# EAGLE design motherboard_zaloha s medi (EAGLE 9.6.2)
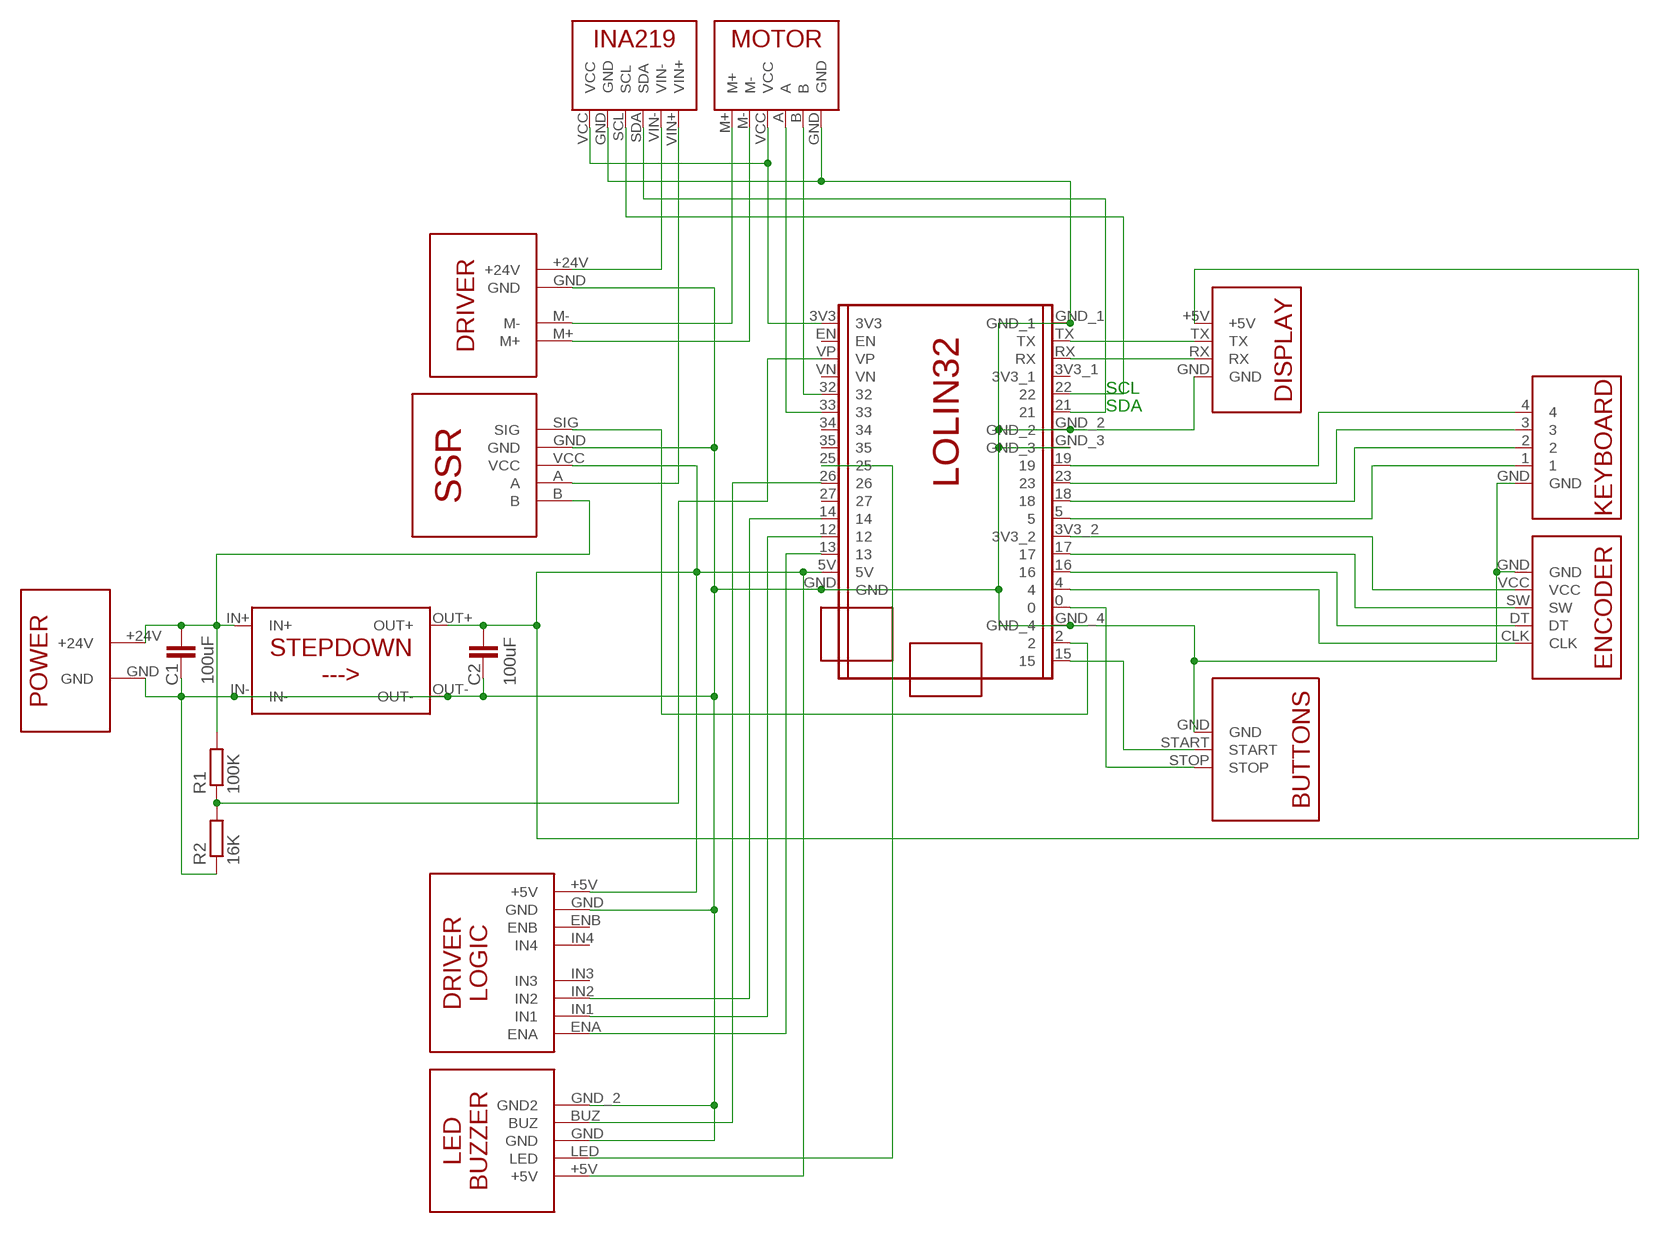
[diagram p0: schematic, sheet 1]

## Parts
C1  100uF  C5/2.5  [C5B2.5]
C2  100uF  C5/2.5  [C5B2.5]
R1  100K  R-EU_0207/7  [0207/7]
R2  16K  R-EU_0207/7  [0207/7]
U$1  B_DISPLAY  [B_DISPLAY]
U$2  INA219  [INA219]
U$3  B_MOTOR  [B_MOTOR]
U$4  B_KLAVESNICE  [B_KLAVESNICE]
U$5  B_LED_BUZ  [B_LED_BUZ]
U$6  B_ENCODER  [B_ENCODER]
U$7  B_SSR_2  [B_SSR_2]
U$8  B_LOLIN32  [B_LOLIN32]
U$9  B_STEPDOWN  [B_STEPDOWN]
U$10  B_DRIVER_3  [B_DRIVER_3]
U$11  B_POWER  [B_POWER]
U$12  B_DRIVER_2  [B_DRIVER_2]
U$13  B_BUTTONS  [B_BUTTONS]

## Nets
+5V [+5V]: C2.1 U$1.+5V U$5.+5V U$7.VCC U$8.5V U$9.OUT+ U$10.+5V
GND [GND]: C1.2 C2.2 R2.1 U$1.GND U$2.GND U$3.GND U$4.GND U$5.GND U$5.GND_2(GND2) U$6.GND U$7.GND U$8.GND U$8.GND_1 U$8.GND_2 U$8.GND_3 U$8.GND_4 U$9.IN- U$9.OUT- U$10.GND U$11.GND U$12.GND U$13.GND
N$1: U$6.VCC U$8.3V3_2
N$2: U$4.1 U$8.5
N$3 [+24v]: U$3.M+ U$12.M-
N$4 [+24v]: U$3.M- U$12.M+
N$5: U$4.2 U$8.18
N$6: U$4.3 U$8.23
N$7: U$6.SW U$8.17
N$8: U$6.DT U$8.16
N$9: U$4.4 U$8.19
N$10: U$8.0 U$13.STOP
N$11: U$7.SIG U$8.2
N$12: U$3.B U$8.32
N$13: U$1.TX U$8.TX
N$14: U$1.RX U$8.RX
N$15: U$3.A U$8.33
N$16: U$6.CLK U$8.4
N$18: U$5.BUZ U$8.26
N$19: U$5.LED U$8.25
N$21 [+24v]: C1.1 R1.2 U$7.B U$9.IN+ U$11.+24V
N$22: U$2.SDA U$8.21
N$23: U$8.15 U$13.START
N$24: U$2.SCL U$8.22
N$27 [+5V]: U$2.VCC U$3.VCC U$8.3V3
N$28 [+24v]: U$2.VIN+ U$7.A
N$29 [+24v]: U$2.VIN- U$12.+24V
N$30: R1.1 R2.2 U$8.VP
N$38: U$8.13 U$10.ENA
N$39: U$8.12 U$10.IN1
N$40: U$8.14 U$10.IN2
Unconnected: U$8.3V3_1 U$8.27 U$8.34 U$8.35 U$8.EN U$8.VN U$10.ENB U$10.IN3 U$10.IN4

## Notes on the sheet
- SCL
- SDA

## Library data of the parts
C1 C2 = capacitor-wima:C: CAPACITOR naming: grid - package width
R1 R2 = rcl:R-EU_: RESISTOR, European symbol; SPICEPREFIX: R
U$1 = 00_arduino:B_DISPLAY
U$2 = 00_arduino:INA219
U$3 = 00_arduino:B_MOTOR
U$4 = 00_arduino:B_KLAVESNICE
U$5 = 00_arduino:B_LED_BUZ
U$6 = 00_arduino:B_ENCODER
U$7 = 00_arduino:B_SSR_2
U$8 = 00_arduino:B_LOLIN32
U$9 = 00_arduino:B_STEPDOWN
U$10 = 00_arduino:B_DRIVER_3
U$11 = 00_arduino:B_POWER
U$12 = 00_arduino:B_DRIVER_2
U$13 = 00_arduino:B_BUTTONS

## Net classes
0 default: width 0.508 mm, clearance 0.127 mm
1 GND: width 1.397 mm, clearance 0.127 mm
2 +5V: width 0.762 mm, clearance 0.127 mm
3 +24v: width 1.397 mm

## Board
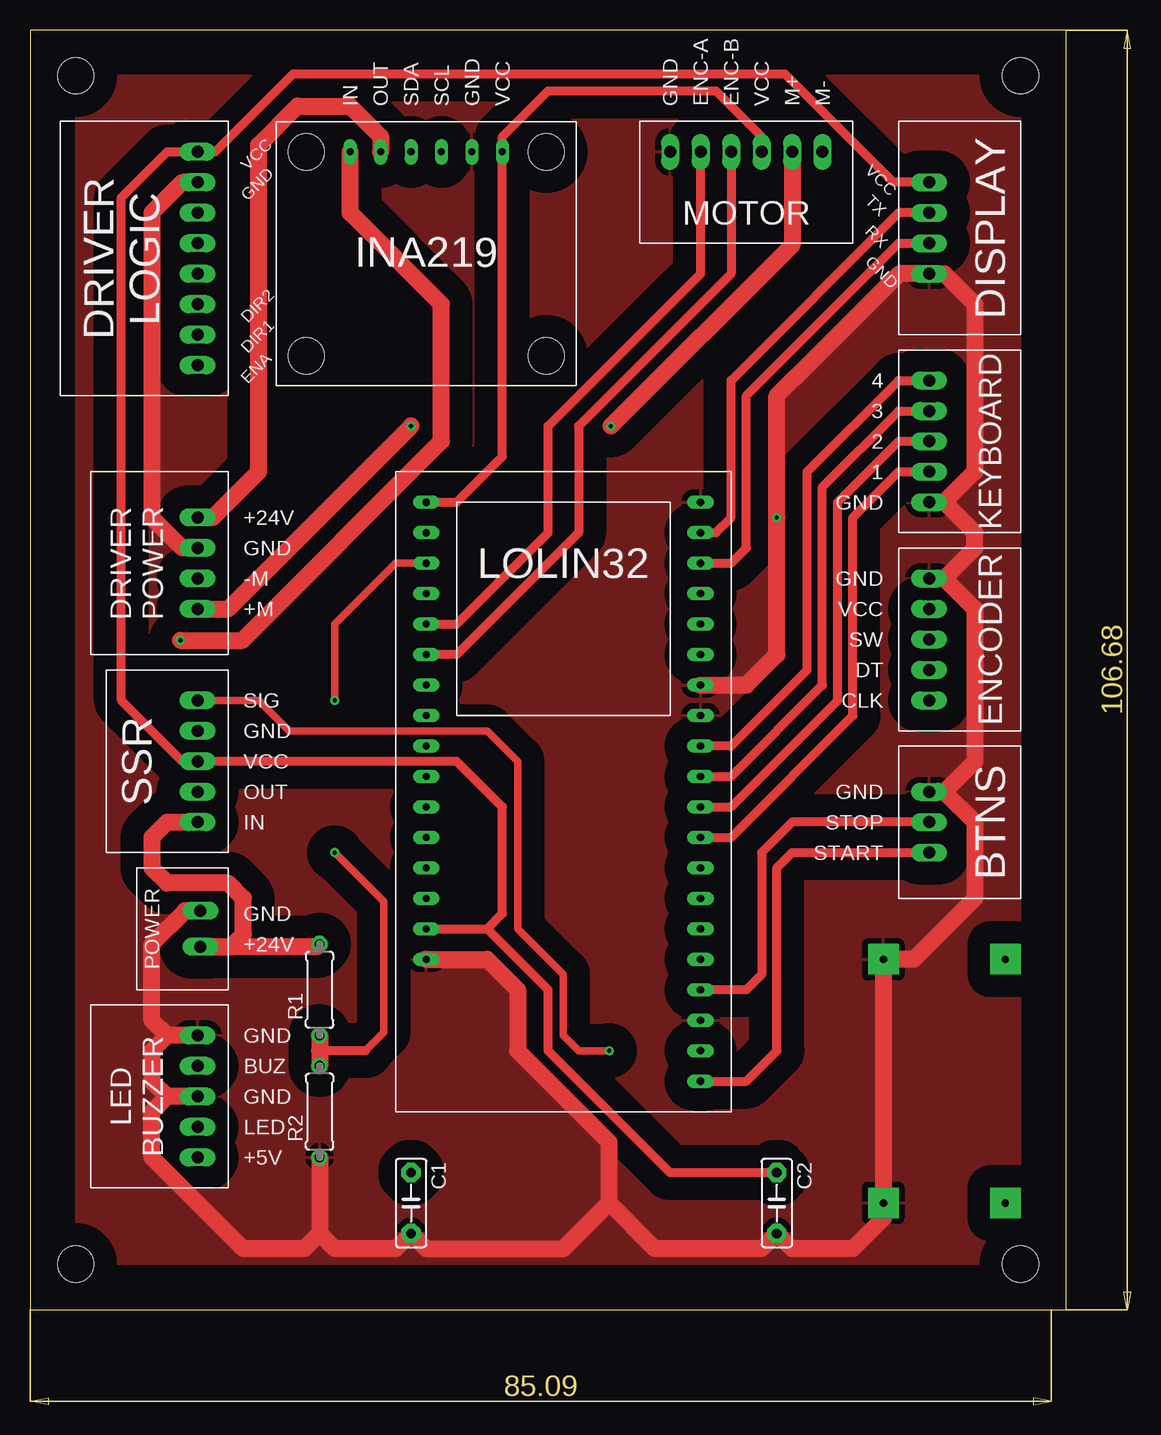
[diagram p1: board, top side]
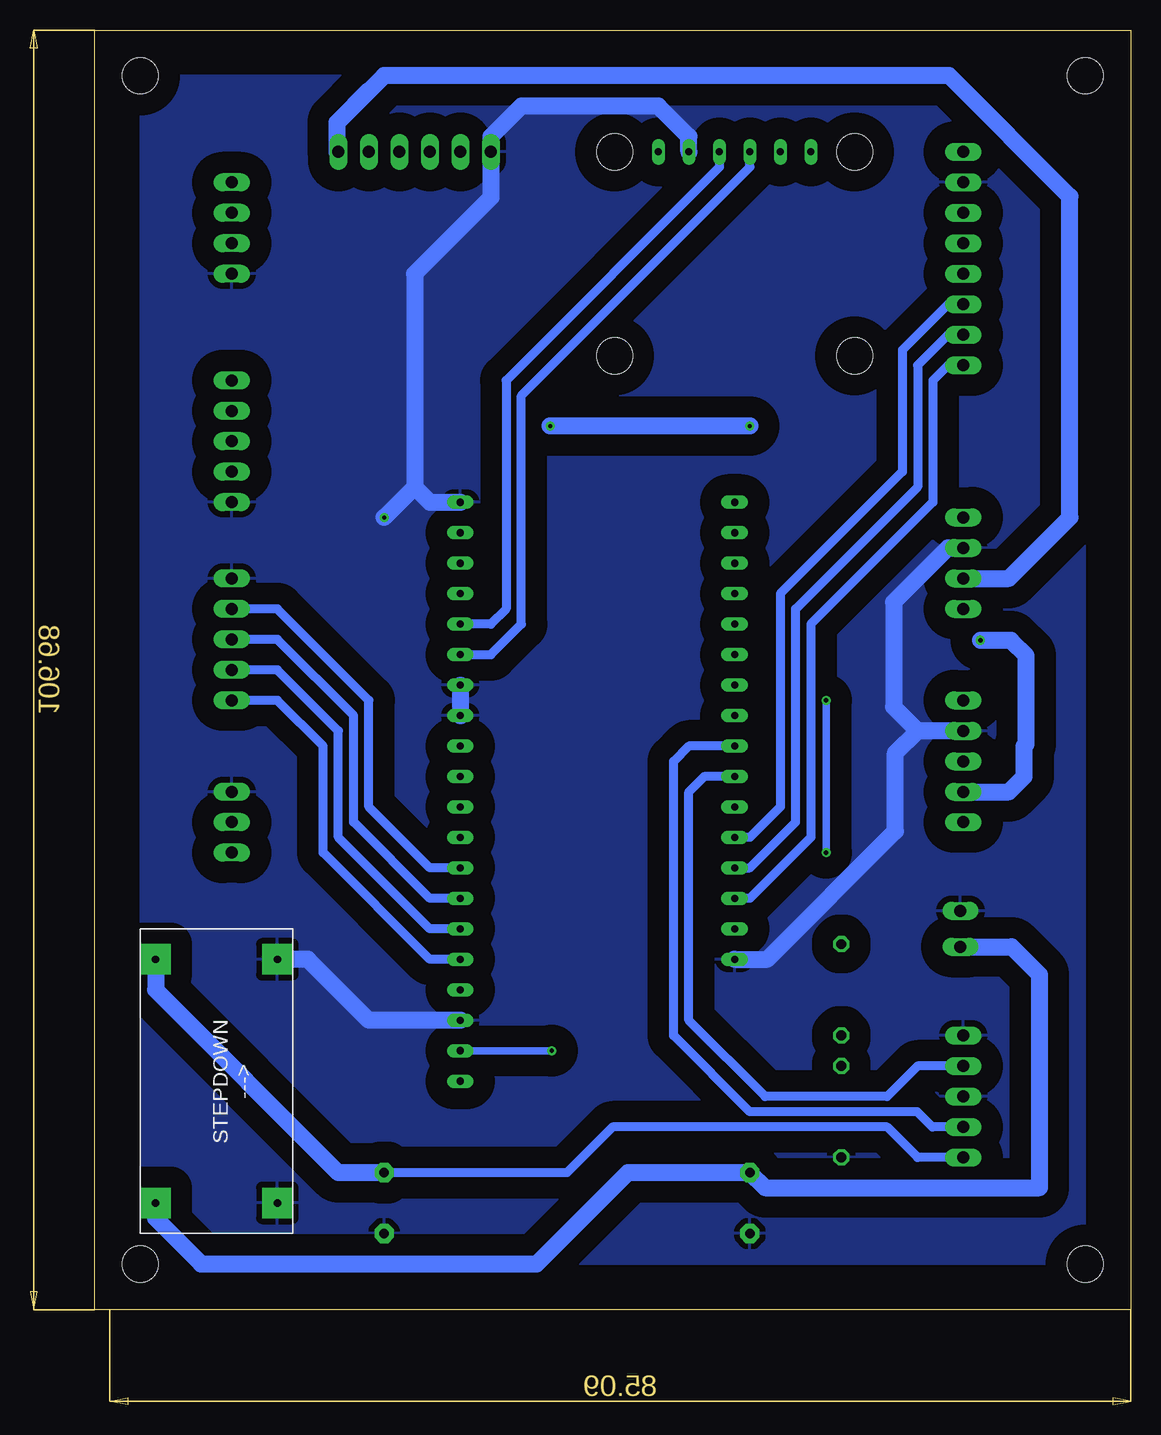
[diagram p2: board, bottom side, seen from below]

Size 86.36 x 106.68 mm. Coordinates in mm from the lower left corner, seen from the top.
Outline: 0,0 86.36,0 86.36,106.68 0,106.68 0,0
Copper layers (1*16): Top 0.035mm / dielectric 1.5mm / Bottom 0.035mm
Design rules "default *": minimum track width 6mil, minimum drill 0.35mm, track to track 6mil, track to pad 6mil, pad to pad 6mil, via to via 6mil, smd to smd 6mil, copper to edge 40mil, drill to drill 6mil, minimum pad ring 10mil, minimum via ring 8mil, stop-mask expansion 4mil, vias tented up to drill 0mil, thermal gap 20mil
Holes 3 mm at 3.81,3.81 82.55,3.81 82.55,102.87 3.81,102.87

### Footprints (pad centres in the part's own frame; a part is rotated, then mirrored left to right if it is on the bottom)
C5B2.5 = drill 0.813 pad 1.6 octagon: 1 -2.54,0; 2 2.54,0
0207/7 = drill 0.813 octagon: 1 -3.81,0; 2 3.81,0
B_DISPLAY = drill 1 long: +5V 0,0; GND 7.62,0; RX 5.08,0; TX 2.54,0
INA219 = drill 0.584 long: GND -3.81,0; SCL -1.27,0; SDA 1.27,0; VCC -6.35,0; VIN+ 6.35,0; VIN- 3.81,0 | hole 3: -10,0; 10,0; -10,17; 10,17
B_MOTOR = drill 1 long: A 2.54,0; B 5.08,0; GND 7.62,0; M+ -5.08,0; M- -2.54,0; VCC 0,0
B_KLAVESNICE = drill 1 long: 1 2.54,0; 2 0,0; 3 -2.54,0; 4 -5.08,0; GND 5.08,0
B_LED_BUZ = drill 1 long: +5V -5.08,0; BUZ 2.54,0; GND 0,0; GND_2 5.08,0; LED -2.54,0
B_ENCODER = drill 1 long: CLK 5.08,0; DT 2.54,0; GND -5.08,0; SW 0,0; VCC -2.54,0
B_SSR_2 = drill 1 long: A -2.54,-2.54; B -5.08,-2.54; GND 2.54,-2.54; SIG 5.08,-2.54; VCC 0,-2.54
B_LOLIN32 = drill 0.6 long: 0 11.43,-27.94; 2 11.43,-33.02; 3V3 -11.43,12.7; 3V3_1 11.43,5.08; 3V3_2 11.43,-17.78; 4 11.43,-25.4; 5 11.43,-15.24; 5V -11.43,-22.86; 12 -11.43,-17.78; 13 -11.43,-20.32; 14 -11.43,-15.24; 15 11.43,-35.56; 16 11.43,-22.86; 17 11.43,-20.32; 18 11.43,-12.7; 19 11.43,-7.62; 21 11.43,0; 22 11.43,2.54; 23 11.43,-10.16; 25 -11.43,-7.62; 26 -11.43,-10.16; 27 -11.43,-12.7; 32 -11.43,2.54; 33 -11.43,0; 34 -11.43,-2.54; 35 -11.43,-5.08; EN -11.43,10.16; GND -11.43,-25.4; GND_1 11.43,12.7; GND_2 11.43,-2.54; GND_3 11.43,-5.08; GND_4 11.43,-30.48; RX 11.43,7.62; TX 11.43,10.16; VN -11.43,5.08; VP -11.43,7.62
B_STEPDOWN = drill 0.6 pad 2.54 square: IN+ -10.16,5.08; IN- -10.16,-5.08; OUT+ 10.16,5.08; OUT- 10.16,-5.08
B_DRIVER_3 = drill 1 long: +5V 17.78,0; ENA 0,0; ENB 12.7,0; GND 15.24,0; IN1 2.54,0; IN2 5.08,0; IN3 7.62,0; IN4 10.16,0
B_POWER = drill 1 long: +24V -1.5,-1.5; GND 1.5,-1.5
B_DRIVER_2 = drill 1 long: +24V 3.81,0; GND 1.27,0; M+ -3.81,0; M- -1.27,0
B_BUTTONS = drill 1 long: GND -2.54,0; START 2.54,0; STOP 0,0

### Placement (x,y rotation side)
C1  31.75,8.89 270 top
C2  62.23,8.89 270 top
R1  24.13,26.67 90 top
R2  24.13,16.51 90 top
U$1  74.93,93.98 270 top
U$2  33.02,96.52 180 top
U$3  60.96,96.52 180 top
U$4  74.93,72.39 270 top
U$5  13.97,17.78 90 top
U$6  74.93,55.88 270 top
U$7  11.43,45.72 90 top
U$8  44.45,54.61 0 top
U$9  76.2,19.05 90 bottom
U$10  13.97,78.74 90 top
U$11  12.7,31.75 90 top
U$12  13.97,62.23 90 top
U$13  74.93,40.64 270 top

### Tracks (layer width: path | path; a pad name or v marks a point on that pad's centre or on a via)
+5V
  Top 0.762: U$1.+5V 74.91,94.04 71.88,94.04 62.9,103.02 21.92,103.02 15.42,96.52 U$10.+5V 11.43,96.52 7.62,92.71 7.62,50.8 12.7,45.72 U$7.VCC 35.56,45.72 39.37,41.91 39.37,33.02 38.1,31.75 | 38.1,31.75 43.18,26.67 43.18,21.59 53.34,11.43 C2.1 | U$8.5V 38.1,31.75
  Bottom 0.762: C2.1 46.99,11.43 43.18,15.24 20.32,15.24 17.78,12.7 U$5.+5V
  Bottom 1.397: U$9.OUT+ 81.28,26.67 66.04,11.43 C2.1
GND  (via drill 0.35)
  Top 1.397: U$11.GND 12.93,33.25 10.16,30.48 10.16,24.13 11.43,22.86 | U$8.GND 38.1,29.21 40.64,26.67 40.64,21.59 48.26,13.97 48.26,8.89 | U$12.GND 12.7,63.5 10.16,66.04 10.16,91.44 12.7,93.98 U$10.GND | U$8.GND_2 59.69,52.07 62.23,54.61 v62.23,66.04 62.23,76.2 63.77,77.74 63.82,77.74 72.44,86.36 U$1.GND 76.2,86.36 78.74,83.82 78.74,69.85 76.2,67.31 | U$5.GND_2 11.43,22.86 | 11.43,22.86 10.16,21.59 10.16,19.05 11.43,17.78 | U$5.GND 11.43,17.78 | 11.43,17.78 10.16,16.51 10.16,12.7 17.78,5.08 22.86,5.08 24.13,6.35 | U$4.GND 76.2,67.31 | 76.2,60.96 78.74,63.5 78.74,64.77 76.2,67.31 | U$6.GND 76.2,60.96 | 76.2,60.96 78.74,58.42 78.74,45.72 76.2,43.18 | U$13.GND 76.2,43.18 | 76.2,43.18 78.74,40.64 78.74,34.29 73.66,29.21 U$9.OUT- U$9.IN- 71.12,7.62 68.58,5.08 63.5,5.08 C2.2 60.96,5.08 52.07,5.08 48.26,8.89 | R2.1 24.13,6.35 | 24.13,6.35 25.4,5.08 30.48,5.08 C1.2 33.02,5.08 44.45,5.08 48.26,8.89
  Bottom 1.397: 17.78,48.26 19.62,46.42 19.62,39.9 30.32,29.21 U$8.GND | U$12.GND 15.25,63.5 19.77,58.98 19.77,50.25 17.78,48.26 | 59.69,68.58 58.42,67.31 U$8.GND_1 | 59.69,68.58 59.69,86.36 53.34,92.71 U$3.GND 53.28,96.52 53.34,96.58 53.34,97.79 50.8,100.33 39.37,100.33 36.83,97.79 U$2.GND | U$7.GND 17.78,48.26 | U$8.GND_4 63.5,24.13 68.58,29.21 U$9.OUT- | U$8.GND_2 U$8.GND_3 | 59.69,68.58 v62.23,66.04
  pour Top (isolate 1.905): 3.81,102.87 3.81,3.81 82.55,3.81 82.55,102.87
  pour Bottom (isolate 1.778): 3.81,102.87 82.55,102.87 82.55,3.81 3.81,3.81
N$1
  Bottom 0.762: U$8.3V3_2 58.42,36.83 63.5,41.91 63.5,50.8 71.12,58.42 U$6.VCC
N$2
  Top 0.762: U$8.5 58.42,39.37 68.58,49.53 68.58,66.04 72.39,69.85 U$4.1
N$3
  Bottom 1.397: U$12.M- 10.16,60.96 5.08,66.04 5.08,92.8 15.15,102.87 62.23,102.87 66.15,98.95 | 63.5,101.64 66.15,98.99 66.15,98.95 | 66.15,98.95 66.15,96.52 U$3.M+
N$4  (via drill 0.35)
  Top 1.397: U$3.M- 63.5,88.76 v48.4,73.66 | U$12.M+ 16.51,58.42 v31.75,73.66
  Bottom 1.397: v31.75,73.66 v48.4,73.66
N$5
  Top 0.762: U$8.18 58.42,41.91 67.31,50.8 67.31,67.31 72.39,72.39 U$4.2
N$6
  Top 0.762: U$8.23 58.42,44.45 66.04,52.07 66.04,68.58 72.39,74.93 U$4.3
N$7
  Bottom 0.762: U$8.17 58.42,34.29 64.77,40.64 64.77,49.53 71.12,55.88 U$6.SW
N$8
  Bottom 0.762: U$8.16 58.42,31.75 66.04,39.37 66.04,48.26 71.12,53.34 U$6.DT
N$9
  Top 0.762: U$8.19 58.42,46.99 64.77,53.34 64.77,69.85 72.39,77.47 U$4.4
N$10
  Top 0.762: U$13.STOP 63.5,40.64 60.96,38.1 60.96,27.94 59.69,26.67 U$8.0
N$11  (via drill 0.35)
  Top 0.635: U$7.SIG 19.05,50.8 21.59,48.26 38.1,48.26 40.64,45.72 40.64,31.75 44.45,27.94 44.45,22.86 45.72,21.59 v48.26,21.59
  Bottom 0.635: v48.26,21.59 U$8.2
N$12
  Top 0.762: U$8.32 35.56,57.15 43.18,64.77 43.18,73.66 55.88,86.36 U$3.B
N$13
  Top 0.762: U$1.TX 72.39,91.44 58.42,77.47 58.42,66.04 57.15,64.77 U$8.TX
N$14
  Top 0.762: U$8.RX 58.42,62.23 59.69,63.5 59.69,76.2 72.39,88.9 U$1.RX
N$15
  Top 0.762: U$3.A 58.42,86.36 45.72,73.66 45.72,64.77 35.56,54.61 U$8.33
N$16
  Bottom 0.762: U$8.4 58.42,29.21 67.31,38.1 67.31,46.99 71.12,50.8 U$6.CLK
N$18
  Bottom 0.762: U$8.26 35.56,44.45 36.83,43.18 36.83,24.13 30.48,17.78 20.32,17.78 17.78,20.32 U$5.BUZ
N$19
  Bottom 0.762: U$8.25 36.83,46.99 38.1,45.72 38.1,22.86 31.75,16.51 17.82,16.51 16.55,15.24 U$5.LED
N$21
  Top 1.397: U$7.B 11.43,40.64 10.16,39.37 10.16,36.83 11.43,35.56 16.51,35.56 17.78,34.29 17.78,31.29 16.74,30.25 U$11.+24V 23.9,30.25 R1.2
  Bottom 1.397: U$11.+24V 9.93,30.25 7.62,27.94 7.62,10.16 30.48,10.16 C1.1 41.91,11.43 49.53,3.81 77.47,3.81 81.28,7.62 U$9.IN+
N$22
  Bottom 0.762: U$8.21 53.34,54.61 50.8,57.15 50.8,76.2 31.75,95.25 U$2.SDA
N$23
  Top 0.762: U$8.15 59.69,19.05 62.23,21.59 62.23,36.83 63.5,38.1 U$13.START
N$24
  Bottom 0.762: U$2.SCL 34.29,95.25 52.07,77.47 52.07,58.42 53.34,57.15 U$8.22
N$27
  Top 0.762: U$8.3V3 35.56,67.31 39.37,71.12 U$2.VCC 39.37,97.79 43.18,101.6 57.15,101.6 60.96,97.79 U$3.VCC
N$28  (via drill 0.35)
  Top 1.397: v12.54,55.8 17.7,55.8 34.29,72.39 34.29,83.82 26.67,91.44 U$2.VIN+
  Bottom 1.397: v12.54,55.8 9.99,55.8 8.72,54.53 8.72,47.16 8.89,46.99 8.89,44.45 10.16,43.18 U$7.A
N$29
  Top 1.397: U$2.VIN- 29.21,97.79 26.67,100.33 22.28,100.33 19.05,97.1 19.05,69.85 15.24,66.04 U$12.+24V
N$30  (via drill 0.35)
  Top 0.635: U$8.VP 30.48,62.23 25.4,57.15 v25.4,50.8 | 27.94,21.59 29.48,23.13 29.48,34.02 v25.4,38.1
  Top 0.762: 27.94,21.59 24.13,21.59
  Top 1.397: R1.1 24.13,21.59 R2.2
  Bottom 0.635: v25.4,50.8 v25.4,38.1
N$38
  Bottom 0.762: U$10.ENA 15.24,78.74 16.51,77.47 16.51,67.31 26.67,57.15 26.67,39.37 31.75,34.29 U$8.13
N$39
  Bottom 0.762: U$8.12 31.75,36.83 27.94,40.64 27.94,58.42 17.78,68.58 17.78,78.74 15.24,81.28 U$10.IN1
N$40
  Bottom 0.762: U$10.IN2 15.24,83.82 19.05,80.01 19.05,69.85 29.21,59.69 29.21,41.91 31.75,39.37 U$8.14

### Text on the board
tNames: IN | OUT | SDA | SCL | GND | VCC | GND | ENC-A | ENC-B | VCC | M+ | M- | VCC | VCC | GND | TX | RX | GND | DIR2 | DIR1 | ENA | 4 | 3 | 2 | 1 | GND | +24V | GND | -M | GND | +M | VCC | SW | DT | SIG | CLK | GND | VCC | OUT | GND | IN | STOP | START | GND | +24V | GND | BUZ | GND | LED | +5V